# Altium schematic sheet MPC23017.SchDoc
size A
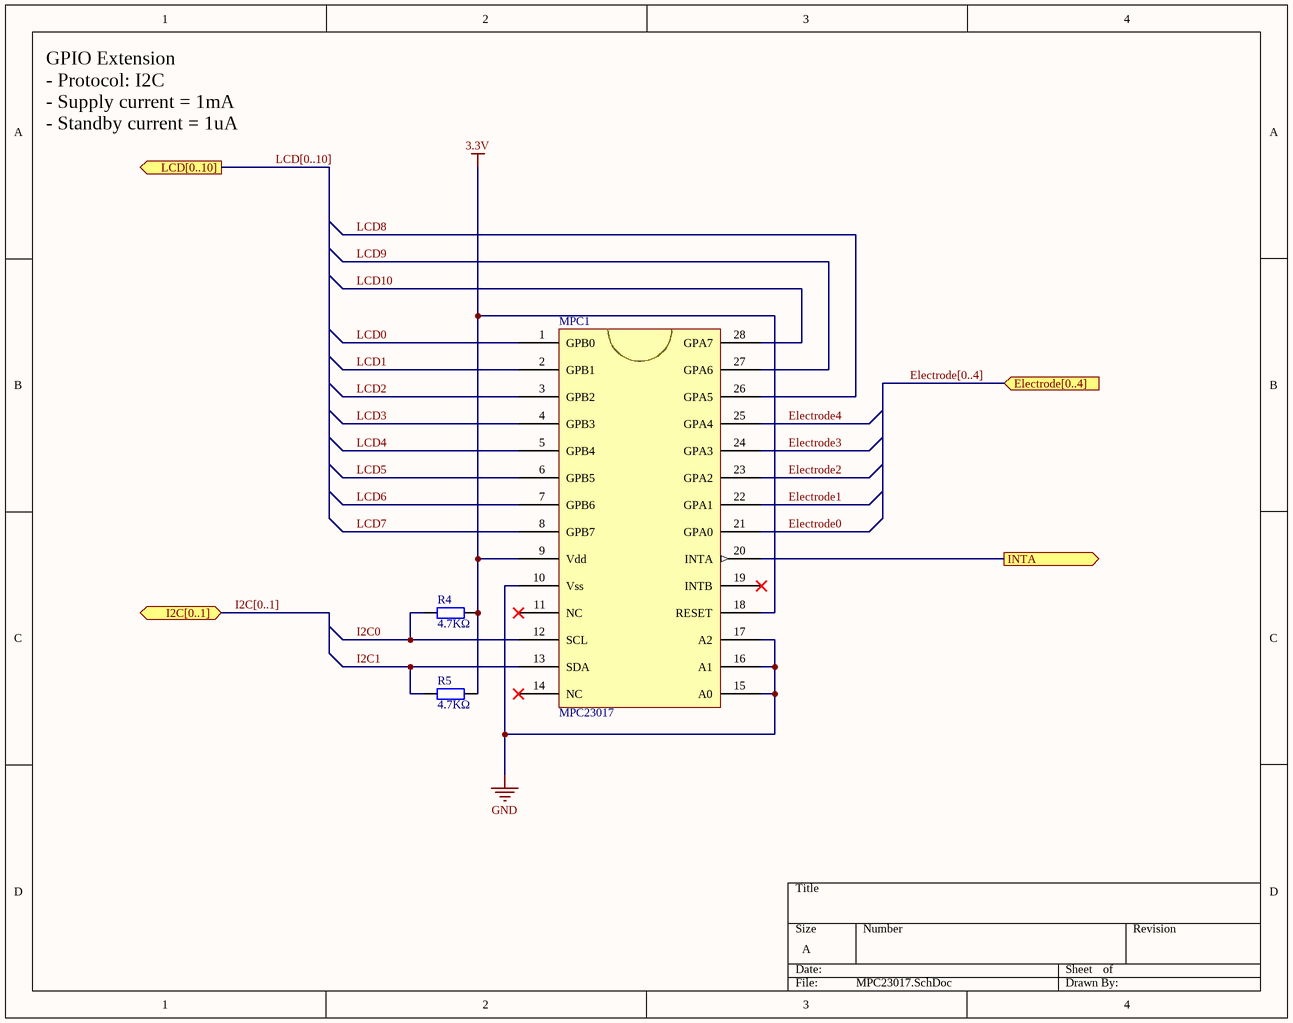
[diagram p0: MPC23017.SchDoc]

## Parts
MPC1  MPC23017
R4  4.7KΩ  [AXIAL-0.4]
R5  4.7KΩ  [AXIAL-0.4]

## Ports
Electrode[0..4] (in), I2C[0..1] (bidir), INTA (out), LCD[0..10] (out)

## Nets
3.3V: MPC1.9(Vdd) MPC1.18(RESET) R4.1 R5.1
GND: MPC1.10(Vss) MPC1.15(A0) MPC1.16(A1) MPC1.17(A2)
Electrode0: MPC1.21(GPA0)
Electrode1: MPC1.22(GPA1)
Electrode2: MPC1.23(GPA2)
Electrode3: MPC1.24(GPA3)
Electrode4: MPC1.25(GPA4)
I2C0: MPC1.12(SCL) R4.2
I2C1: MPC1.13(SDA) R5.2
INTA: MPC1.20(INTA) ; port INTA
LCD0: MPC1.1(GPB0)
LCD1: MPC1.2(GPB1)
LCD2: MPC1.3(GPB2)
LCD3: MPC1.4(GPB3)
LCD4: MPC1.5(GPB4)
LCD5: MPC1.6(GPB5)
LCD6: MPC1.7(GPB6)
LCD7: MPC1.8(GPB7)
LCD8: MPC1.26(GPA5)
LCD9: MPC1.27(GPA6)
LCD10: MPC1.28(GPA7)

Not connected (* = marked no-connect by the designer): MPC1 11(NC)* 14(NC)* 19(INTB)*

## Buses and harness runs
bus Electrode[0..4] = port Electrode[0..4]
bus I2C[0..1] = port I2C[0..1]
bus LCD[0..10] = port LCD[0..10]

## Notes on the sheet
- GPIO Extension
  - Protocol: I2C
  - Supply current = 1mA
  - Standby current = 1uA

## Library data of the parts
MPC1 = Component_1
R4 R5 = Res2: Resistor; Value: 1K; Published: 8-Jun-2000; LatestRevisionDate: 17-Jul-2002; LatestRevisionNote: Re-released for DXP Platform.; PackageReference: AXIAL-0.4; Publisher: Altium Limited; PackageDescription: Axial Device, Thru-Hole; 2 Leads; 0.4 in Pin Spacing